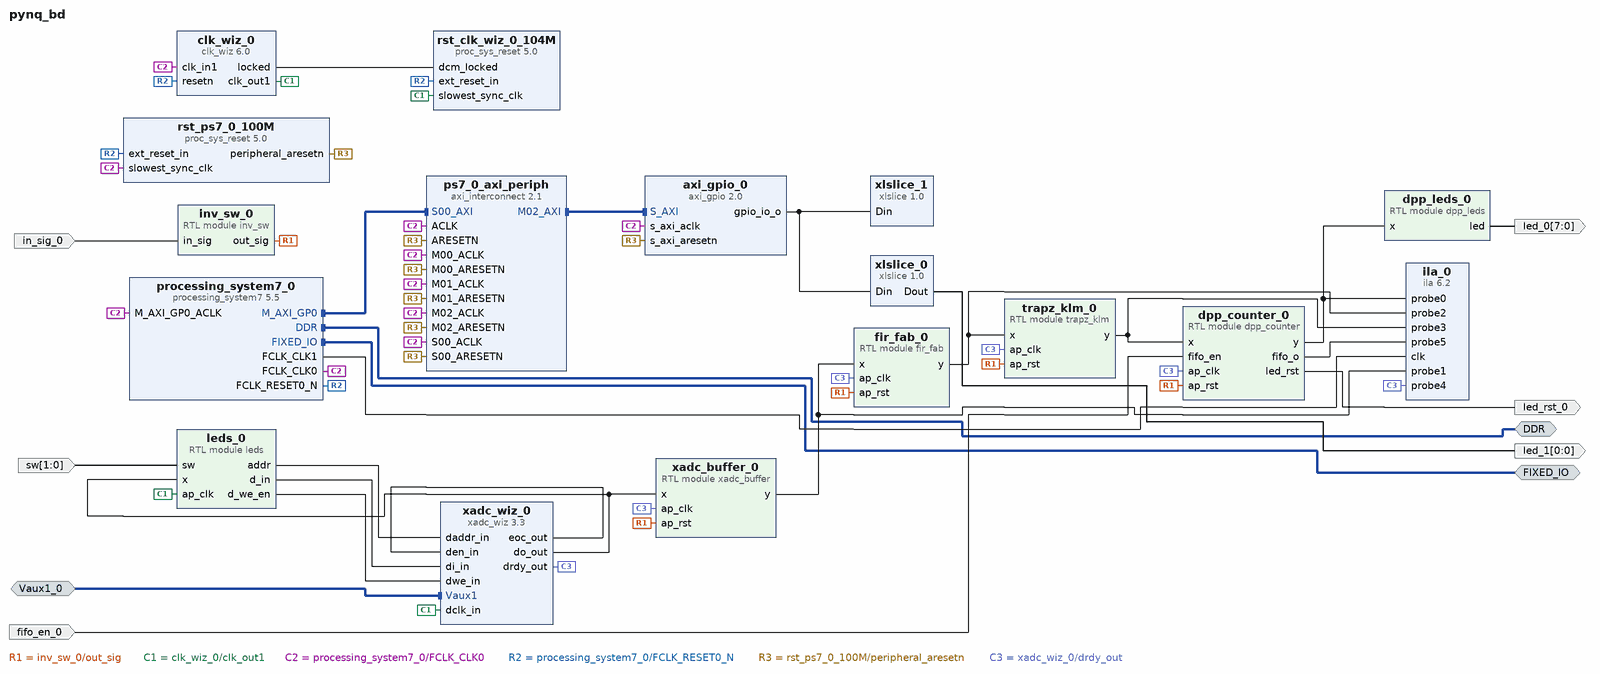
[diagram p0: block diagram of the top level]
# Vivado block design pynq_bd, xc7z020clg400-1, Vivado 2022.2
create_bd_design pynq_bd

create_bd_intf_port -mode Master -vlnv xilinx.com:interface:ddrx_rtl:1.0 DDR
create_bd_intf_port -mode Master -vlnv xilinx.com:display_processing_system7:fixedio_rtl:1.0 FIXED_IO
create_bd_intf_port -mode Slave -vlnv xilinx.com:interface:diff_analog_io_rtl:1.0 Vaux1_0
create_bd_port -dir I -from 1 -to 0 sw
create_bd_port -dir O -from 7 -to 0 led_0
create_bd_port -dir O -type rst led_rst_0
create_bd_port -dir O -from 0 -to 0 led_1
create_bd_port -dir I fifo_en_0
create_bd_port -dir I in_sig_0

create_bd_cell -type ip -vlnv xilinx.com:ip:processing_system7:5.5 processing_system7_0
set_property -dict [list \
  CONFIG.PCW_APU_PERIPHERAL_FREQMHZ 650 \
  CONFIG.PCW_CRYSTAL_PERIPHERAL_FREQMHZ 50 \
  CONFIG.PCW_ENET0_ENET0_IO {MIO 16 .. 27} \
  CONFIG.PCW_ENET0_GRP_MDIO_ENABLE 1 \
  CONFIG.PCW_ENET0_GRP_MDIO_IO {MIO 52 .. 53} \
  CONFIG.PCW_ENET0_PERIPHERAL_ENABLE 1 \
  CONFIG.PCW_ENET0_RESET_ENABLE 1 \
  CONFIG.PCW_ENET0_RESET_IO {MIO 9} \
  CONFIG.PCW_ENET_RESET_ENABLE 1 \
  CONFIG.PCW_ENET_RESET_SELECT {Share reset pin} \
  CONFIG.PCW_EN_CLK1_PORT 1 \
  CONFIG.PCW_FCLK_CLK1_BUF TRUE \
  CONFIG.PCW_FPGA0_PERIPHERAL_FREQMHZ 100 \
  CONFIG.PCW_FPGA1_PERIPHERAL_FREQMHZ 10 \
  CONFIG.PCW_FPGA_FCLK1_ENABLE 1 \
  CONFIG.PCW_GPIO_MIO_GPIO_ENABLE 1 \
  CONFIG.PCW_GPIO_MIO_GPIO_IO MIO \
  CONFIG.PCW_I2C_RESET_ENABLE 1 \
  CONFIG.PCW_IRQ_F2P_INTR 1 \
  CONFIG.PCW_M_AXI_GP0_FREQMHZ 10 \
  CONFIG.PCW_PERIPHERAL_BOARD_PRESET part0 \
  CONFIG.PCW_PRESET_BANK1_VOLTAGE {LVCMOS 1.8V} \
  CONFIG.PCW_QSPI_GRP_FBCLK_ENABLE 1 \
  CONFIG.PCW_QSPI_GRP_FBCLK_IO {MIO 8} \
  CONFIG.PCW_QSPI_GRP_SINGLE_SS_ENABLE 1 \
  CONFIG.PCW_QSPI_GRP_SINGLE_SS_IO {MIO 1 .. 6} \
  CONFIG.PCW_QSPI_PERIPHERAL_ENABLE 1 \
  CONFIG.PCW_QSPI_QSPI_IO {MIO 1 .. 6} \
  CONFIG.PCW_SD0_GRP_CD_ENABLE 1 \
  CONFIG.PCW_SD0_GRP_CD_IO {MIO 47} \
  CONFIG.PCW_SD0_GRP_WP_ENABLE 0 \
  CONFIG.PCW_SD0_PERIPHERAL_ENABLE 1 \
  CONFIG.PCW_SD0_SD0_IO {MIO 40 .. 45} \
  CONFIG.PCW_SDIO_PERIPHERAL_FREQMHZ 50 \
  CONFIG.PCW_SINGLE_QSPI_DATA_MODE x4 \
  CONFIG.PCW_UART0_PERIPHERAL_ENABLE 1 \
  CONFIG.PCW_UART0_UART0_IO {MIO 14 .. 15} \
  CONFIG.PCW_UART1_PERIPHERAL_ENABLE 0 \
  CONFIG.PCW_UART_PERIPHERAL_FREQMHZ 100 \
  CONFIG.PCW_UIPARAM_DDR_BUS_WIDTH {16 Bit} \
  CONFIG.PCW_UIPARAM_DDR_FREQ_MHZ 525 \
  CONFIG.PCW_UIPARAM_DDR_PARTNO {MT41J256M16 RE-125} \
  CONFIG.PCW_USB0_PERIPHERAL_ENABLE 1 \
  CONFIG.PCW_USB0_RESET_ENABLE 1 \
  CONFIG.PCW_USB0_RESET_IO {MIO 46} \
  CONFIG.PCW_USB0_USB0_IO {MIO 28 .. 39} \
  CONFIG.PCW_USB_RESET_ENABLE 1 \
  CONFIG.PCW_USB_RESET_SELECT {Share reset pin} \
  CONFIG.PCW_USE_FABRIC_INTERRUPT 1 \
] [get_bd_cells processing_system7_0]
# 494 more settings of processing_system7_0 are not shown: defaults, MIO pin electricals, DDR timing, and values the tool derives
create_bd_cell -type ip -vlnv xilinx.com:ip:xadc_wiz:3.3 xadc_wiz_0
set_property -dict [list \
  CONFIG.ADC_CONVERSION_RATE 1000 \
  CONFIG.ADC_OFFSET_AND_GAIN_CALIBRATION false \
  CONFIG.DCLK_FREQUENCY 104 \
  CONFIG.ENABLE_AXI4STREAM false \
  CONFIG.ENABLE_CALIBRATION_AVERAGING false \
  CONFIG.ENABLE_RESET true \
  CONFIG.ENABLE_VCCDDRO_ALARM false \
  CONFIG.ENABLE_VCCPAUX_ALARM false \
  CONFIG.ENABLE_VCCPINT_ALARM false \
  CONFIG.FIFO_DEPTH 256 \
  CONFIG.INTERFACE_SELECTION ENABLE_DRP \
  CONFIG.NUM_WAVE 500 \
  CONFIG.OT_ALARM false \
  CONFIG.SENSOR_OFFSET_AND_GAIN_CALIBRATION false \
  CONFIG.SIM_FILE_SEL Default \
  CONFIG.SINGLE_CHANNEL_SELECTION VAUXP1_VAUXN1 \
  CONFIG.STIMULUS_FREQ 400 \
  CONFIG.USER_TEMP_ALARM false \
  CONFIG.VCCAUX_ALARM false \
  CONFIG.VCCINT_ALARM false \
  CONFIG.WAVEFORM_TYPE SIN \
] [get_bd_cells xadc_wiz_0]
create_bd_cell -type ip -vlnv xilinx.com:ip:clk_wiz:6.0 clk_wiz_0
set_property -dict [list \
  CONFIG.CLKOUT1_JITTER 129.027 \
  CONFIG.CLKOUT1_PHASE_ERROR 99.281 \
  CONFIG.CLKOUT1_REQUESTED_OUT_FREQ 104.000 \
  CONFIG.CLKOUT2_JITTER 132.637 \
  CONFIG.CLKOUT2_PHASE_ERROR 102.245 \
  CONFIG.CLKOUT2_REQUESTED_OUT_FREQ 104.000 \
  CONFIG.CLKOUT2_USED false \
  CONFIG.MMCM_CLKFBOUT_MULT_F 9.750 \
  CONFIG.MMCM_CLKOUT0_DIVIDE_F 9.375 \
  CONFIG.MMCM_CLKOUT1_DIVIDE 1 \
  CONFIG.NUM_OUT_CLKS 1 \
  CONFIG.RESET_PORT resetn \
  CONFIG.RESET_TYPE ACTIVE_LOW \
] [get_bd_cells clk_wiz_0]
create_bd_cell -type ip -vlnv xilinx.com:ip:proc_sys_reset:5.0 rst_clk_wiz_0_104M
create_bd_cell -type ip -vlnv xilinx.com:ip:axi_interconnect:2.1 ps7_0_axi_periph
set_property -dict {CONFIG.NUM_MI 3} [get_bd_cells ps7_0_axi_periph]
create_bd_cell -type ip -vlnv xilinx.com:ip:proc_sys_reset:5.0 rst_ps7_0_100M
create_bd_cell -type ip -vlnv xilinx.com:ip:axi_gpio:2.0 axi_gpio_0
set_property -dict {CONFIG.C_ALL_OUTPUTS 0 CONFIG.C_GPIO_WIDTH 2} [get_bd_cells axi_gpio_0]
create_bd_cell -type module -reference leds leds_0
create_bd_cell -type ip -vlnv xilinx.com:ip:xlslice:1.0 xlslice_0
set_property -dict {CONFIG.DIN_WIDTH 2} [get_bd_cells xlslice_0]
create_bd_cell -type ip -vlnv xilinx.com:ip:xlslice:1.0 xlslice_1
set_property -dict {CONFIG.DIN_FROM 1 CONFIG.DIN_TO 1 CONFIG.DIN_WIDTH 2} [get_bd_cells xlslice_1]
create_bd_cell -type ip -vlnv xilinx.com:ip:ila:6.2 ila_0
set_property -dict [list \
  CONFIG.C_DATA_DEPTH 16384 \
  CONFIG.C_MONITOR_TYPE Native \
  CONFIG.C_NUM_OF_PROBES 6 \
  CONFIG.C_PROBE0_TYPE 0 \
  CONFIG.C_PROBE0_WIDTH 32 \
  CONFIG.C_PROBE1_TYPE 1 \
  CONFIG.C_PROBE1_WIDTH 32 \
  CONFIG.C_PROBE2_TYPE 1 \
  CONFIG.C_PROBE2_WIDTH 32 \
  CONFIG.C_PROBE3_TYPE 1 \
  CONFIG.C_PROBE3_WIDTH 32 \
  CONFIG.C_PROBE4_TYPE 1 \
  CONFIG.C_PROBE4_WIDTH 1 \
  CONFIG.C_PROBE5_TYPE 0 \
  CONFIG.C_PROBE5_WIDTH 32 \
  CONFIG.C_TRIGIN_EN false \
  CONFIG.C_TRIGOUT_EN false \
] [get_bd_cells ila_0]
create_bd_cell -type module -reference dpp_leds dpp_leds_0
create_bd_cell -type module -reference fir_fab fir_fab_0
create_bd_cell -type module -reference trapz_klm trapz_klm_0
create_bd_cell -type module -reference dpp_counter dpp_counter_0
create_bd_cell -type module -reference xadc_buffer xadc_buffer_0
create_bd_cell -type module -reference inv_sw inv_sw_0

# ---- connections ----

connect_bd_intf_net -intf_net Vaux1_0_1 [get_bd_intf_ports Vaux1_0] [get_bd_intf_pins xadc_wiz_0/Vaux1]
connect_bd_intf_net [get_bd_intf_ports DDR] [get_bd_intf_pins processing_system7_0/DDR]
connect_bd_intf_net [get_bd_intf_ports FIXED_IO] [get_bd_intf_pins processing_system7_0/FIXED_IO]
connect_bd_intf_net [get_bd_intf_pins processing_system7_0/M_AXI_GP0] [get_bd_intf_pins ps7_0_axi_periph/S00_AXI]
connect_bd_intf_net [get_bd_intf_pins ps7_0_axi_periph/M02_AXI] [get_bd_intf_pins axi_gpio_0/S_AXI]
connect_bd_net -net ap_rst_0_1 [get_bd_pins inv_sw_0/out_sig] \
  [get_bd_pins fir_fab_0/ap_rst] [get_bd_pins trapz_klm_0/ap_rst] [get_bd_pins dpp_counter_0/ap_rst] \
  [get_bd_pins xadc_buffer_0/ap_rst]
connect_bd_net [get_bd_pins axi_gpio_0/gpio_io_o] [get_bd_pins xlslice_1/Din] [get_bd_pins xlslice_0/Din]
connect_bd_net [get_bd_pins clk_wiz_0/clk_out1] \
  [get_bd_pins rst_clk_wiz_0_104M/slowest_sync_clk] [get_bd_pins leds_0/ap_clk] [get_bd_pins xadc_wiz_0/dclk_in]
connect_bd_net [get_bd_pins clk_wiz_0/locked] [get_bd_pins rst_clk_wiz_0_104M/dcm_locked]
connect_bd_net [get_bd_pins dpp_counter_0/fifo_o] [get_bd_pins ila_0/probe5]
connect_bd_net [get_bd_pins dpp_counter_0/led_rst] [get_bd_ports led_rst_0]
connect_bd_net [get_bd_pins dpp_counter_0/y] [get_bd_pins dpp_leds_0/x] [get_bd_pins ila_0/probe0]
connect_bd_net [get_bd_pins dpp_leds_0/led] [get_bd_ports led_0]
connect_bd_net -net fifo_en_0_1 [get_bd_ports fifo_en_0] [get_bd_pins dpp_counter_0/fifo_en]
connect_bd_net [get_bd_pins fir_fab_0/y] [get_bd_pins ila_0/probe2] [get_bd_pins trapz_klm_0/x]
connect_bd_net -net in_sig_0_1 [get_bd_ports in_sig_0] [get_bd_pins inv_sw_0/in_sig]
connect_bd_net [get_bd_pins leds_0/addr] [get_bd_pins xadc_wiz_0/daddr_in]
connect_bd_net [get_bd_pins leds_0/d_in] [get_bd_pins xadc_wiz_0/di_in]
connect_bd_net [get_bd_pins leds_0/d_we_en] [get_bd_pins xadc_wiz_0/dwe_in]
connect_bd_net [get_bd_pins processing_system7_0/FCLK_CLK0] \
  [get_bd_pins clk_wiz_0/clk_in1] [get_bd_pins processing_system7_0/M_AXI_GP0_ACLK] [get_bd_pins ps7_0_axi_periph/S00_ACLK] \
  [get_bd_pins rst_ps7_0_100M/slowest_sync_clk] [get_bd_pins ps7_0_axi_periph/M00_ACLK] [get_bd_pins ps7_0_axi_periph/ACLK] \
  [get_bd_pins ps7_0_axi_periph/M01_ACLK] [get_bd_pins axi_gpio_0/s_axi_aclk] [get_bd_pins ps7_0_axi_periph/M02_ACLK]
connect_bd_net [get_bd_pins processing_system7_0/FCLK_CLK1] [get_bd_pins ila_0/clk]
connect_bd_net [get_bd_pins processing_system7_0/FCLK_RESET0_N] \
  [get_bd_pins clk_wiz_0/resetn] [get_bd_pins rst_clk_wiz_0_104M/ext_reset_in] [get_bd_pins rst_ps7_0_100M/ext_reset_in]
connect_bd_net [get_bd_pins rst_ps7_0_100M/peripheral_aresetn] \
  [get_bd_pins ps7_0_axi_periph/S00_ARESETN] [get_bd_pins ps7_0_axi_periph/M00_ARESETN] \
  [get_bd_pins ps7_0_axi_periph/ARESETN] [get_bd_pins ps7_0_axi_periph/M01_ARESETN] [get_bd_pins axi_gpio_0/s_axi_aresetn] \
  [get_bd_pins ps7_0_axi_periph/M02_ARESETN]
connect_bd_net -net sw_0_1 [get_bd_ports sw] [get_bd_pins leds_0/sw]
connect_bd_net [get_bd_pins trapz_klm_0/y] [get_bd_pins ila_0/probe3] [get_bd_pins dpp_counter_0/x]
connect_bd_net [get_bd_pins xadc_buffer_0/y] [get_bd_pins ila_0/probe1] [get_bd_pins fir_fab_0/x]
connect_bd_net [get_bd_pins xadc_wiz_0/do_out] [get_bd_pins leds_0/x] [get_bd_pins xadc_buffer_0/x]
connect_bd_net [get_bd_pins xadc_wiz_0/drdy_out] \
  [get_bd_pins fir_fab_0/ap_clk] [get_bd_pins trapz_klm_0/ap_clk] [get_bd_pins ila_0/probe4] \
  [get_bd_pins dpp_counter_0/ap_clk] [get_bd_pins xadc_buffer_0/ap_clk]
connect_bd_net [get_bd_pins xadc_wiz_0/eoc_out] [get_bd_pins xadc_wiz_0/den_in]
connect_bd_net [get_bd_pins xlslice_0/Dout] [get_bd_ports led_1]

# ---- address map ----
assign_bd_address -offset 0x41200000 -range 64K -target_address_space [get_bd_addr_spaces processing_system7_0/Data] [get_bd_addr_segs axi_gpio_0/S_AXI/Reg]

validate_bd_design
save_bd_design
